# Altium schematic sheet 100_ESP.SchDoc
size A; SheetNumber: 3; SheetTotal: 5
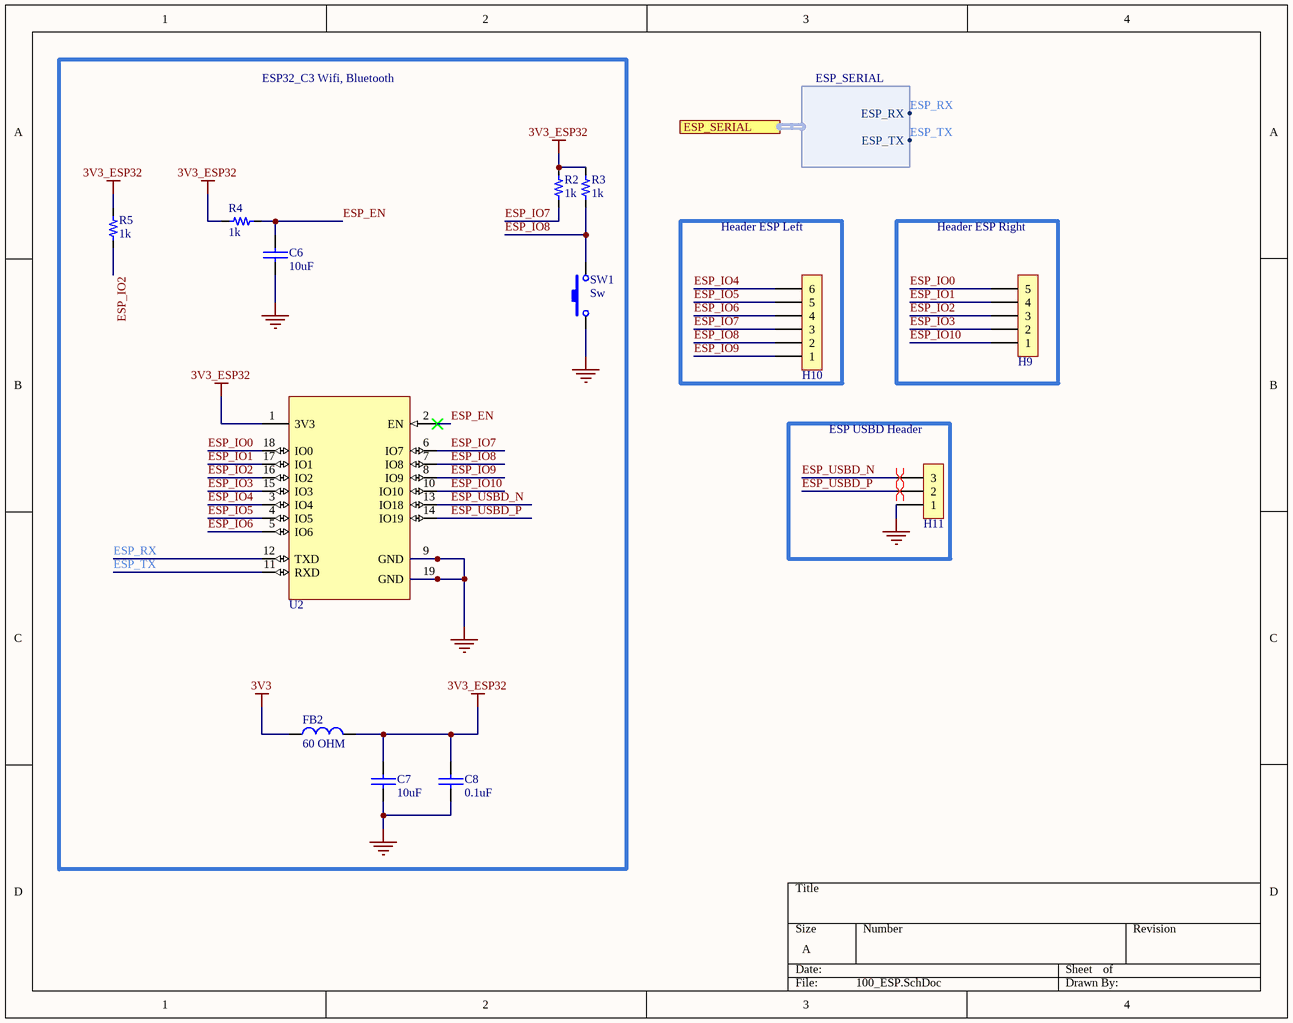
[diagram p0: 100_ESP.SchDoc]

## Parts
C6  value 10uF  [0805_cap]  (hidden comment: 10uF 25V)
C7  value 10uF  [0805_cap]  (hidden comment: 10uF 25V)
C8  value 0.1uF  [0603_cap]  (hidden comment: 0.1uF 50V)
FB2  value 60 OHM  [0603_fb]  (hidden comment: 60OHM 2A)
H9  5x1  [H_5x1_TH_100mil]  (value not drawn)  (no BOM)
H10  6x1  [H_6x1_TH_100mil]  (value not drawn)  (no BOM)
H11  3x1  [H_3X1_TH_100mil]  (value not drawn)  (no BOM)
R2  value 1k  [0603_res]  (hidden comment: 1k 1/10W)
R3  value 1k  [0603_res]  (hidden comment: 1k 1/10W)
R4  value 1k  [0603_res]  (hidden comment: 1k 1/10W)
R5  value 1k  [0603_res]  (hidden comment: 1k 1/10W)
SW1  Sw  [Sw_PUSH_4.5x4.5x5mm]
U2  ESP32-C3-WROOM-02-N4  [ESP32-C3-WROOM-02-N4]  (value not drawn)

## Blocks framed on the sheet
ESP32_C3 Wifi, Bluetooth: C6-C8 FB2 R2-R5 SW1 U2
Header ESP Left: H10
Header ESP Right: H9
ESP USBD Header: H11

## Ports
ESP_SERIAL (harness ESP_SERIAL, see Main[2B], 000_STM[3C])

## Harnesses
ESP_SERIAL: ESP_RX, ESP_TX

## Nets
3V3: FB2.1
3V3_ESP32: C7.1 C8.1 FB2.2 R2.2 R3.2 R4.2 R5.2 U2.1(3V3)
GND: C6.2 C7.2 C8.2 H11.1 SW1.1 U2.9(GND) U2.19(GND)
ESP_EN: C6.1 R4.1 U2.2(EN)
ESP_IO0: H9.5 U2.18(IO0)
ESP_IO1: H9.4 U2.17(IO1)
ESP_IO2: H9.3 R5.1 U2.16(IO2)
ESP_IO3: H9.2 U2.15(IO3)
ESP_IO4: H10.6 U2.3(IO4)
ESP_IO5: H10.5 U2.4(IO5)
ESP_IO6: H10.4 U2.5(IO6)
ESP_IO7: H10.3 R2.1 U2.6(IO7)
ESP_IO8: H10.2 R3.1 SW1.2 U2.7(IO8)
ESP_IO9: H10.1 U2.8(IO9)
ESP_IO10: H9.1 U2.10(IO10)
ESP_RX: U2.12(TXD) ; port ESP_SERIAL.ESP_RX
ESP_TX: U2.11(RXD) ; port ESP_SERIAL.ESP_TX
ESP_USBD_N: H11.3 U2.13(IO18)
ESP_USBD_P: H11.2 U2.14(IO19)

## Layout directives
differential pair; differential pair class USB_2.0_ESP: ESP_USBD_N, ESP_USBD_P

## Library data of the parts
C6 C7 = Cap_10uF_0805_25V_: 25V 10uF X5R ±10% 0805 Multilayer Ceramic Capacitors MLCC - SMD/SMT ROHS; Manufacturer: Samsung Electro-Mechanics; Manufacturer Part Number: CL21A106KAYNNNE; Supplier 1: LCSC; Supplier Part Number 1: C15850; ComponentLink1Description: LCSC; ComponentLink1URL: https://lcsc.com/product-detail/Multilayer-Ceramic-Capacitors-MLCC-SMD-SMT_Samsung-Electro-Mechanics-CL21A106KAYNNNE_C15850.html
C8 = Cap_0.1uF_0603_50V: 50V 100nF Y5V -20%~+80% 0603 Multilayer Ceramic Capacitors MLCC - SMD/SMT ROHS; Manufacturer: Walsin Tech Corp; Manufacturer Part Number: 0603F104Z500CT; Supplier 1: LCSC; Supplier Part Number 1: C83060; ComponentLink1Description: LCSC; ComponentLink1URL: https://www.lcsc.com/product-detail/Multilayer-Ceramic-Capacitors-MLCC-SMD-SMT_Walsin-Tech-Corp-0603F104Z500CT_C83060.html
FB2 = FB_60_0603_2A: 2A 1 100mΩ 60Ω@100MHz ±25% 0603 Ferrite Beads ROHS; Manufacturer: TAI-TECH; Manufacturer Part Number: HCB1608KF-600T20; ComponentLink1Description: LCSC; ComponentLink1URL: https://www.lcsc.com/product-detail/Ferrite-Beads_TAI-TECH-HCB1608KF-600T20_C369516.html; Supplier 1: LCSC; Supplier Part Number 1: C369516
H9 = H_Male_5x1_TH_100mil: ComponentLink1Description: LCSC
H10 = H_Male_6x1_TH_100mil: ComponentLink1Description: LCSC
H11 = H_Male_3x1_TH_100mil: ComponentLink1Description: LCSC
R2-R5 = Res_1k_0603_1/10W: RES SMD 1k OHM 5% 1/10W 0603; Manufacturer: FOJAN; Manufacturer Part Number: FRC0603J102 TS; ComponentLink1URL: https://www.lcsc.com/product-detail/Chip-Resistor-Surface-Mount_FOJAN-FRC0603J102-TS_C2907113.html; Supplier 1: LCSC; Supplier Part Number 1: C2907113; ComponentLink1Description: LCSC
SW1 = Sw_PUSH_4.5x4.5x5.0xmm: SWITCH TACTILE SPST-NO 0.05A 12V; Manufacturer: BZCN; Manufacturer Part Number: TSC015A05026A; Supplier 1: LCSC; Supplier Part Number 1: C2888509; Last modified by: N-A.Potosi; Last modified date: 20190222; ComponentLink1Description: LCSC; ComponentLink1URL: https://www.lcsc.com/product-detail/Tactile-Switches_BZCN-TSC015A05026A_C2888509.html
U2 = MCU_ESP32-C3-WROOM-02-N4: RF TXRX MOD BT WIFI PCB TH SMD; Manufacturer: Espressif Systems; Manufacturer Part Number: ESP32-C3-WROOM-02-N4; Supplier 1: LCSC; Supplier Part Number 1: C2934560; ComponentLink1Description: LCSC; ComponentLink1URL: https://lcsc.com/product-detail/WiFi-Modules_Espressif-Systems-ESP32-C3-WROOM-02-N4_C2934560.html